# Altium schematic sheet Filter Capacitors - Port A.SchDoc: PORT A Filter Capacitors
size 292 x 193 mm; DocumentNumber: 37; SheetNumber: 25; SheetTotal: 43
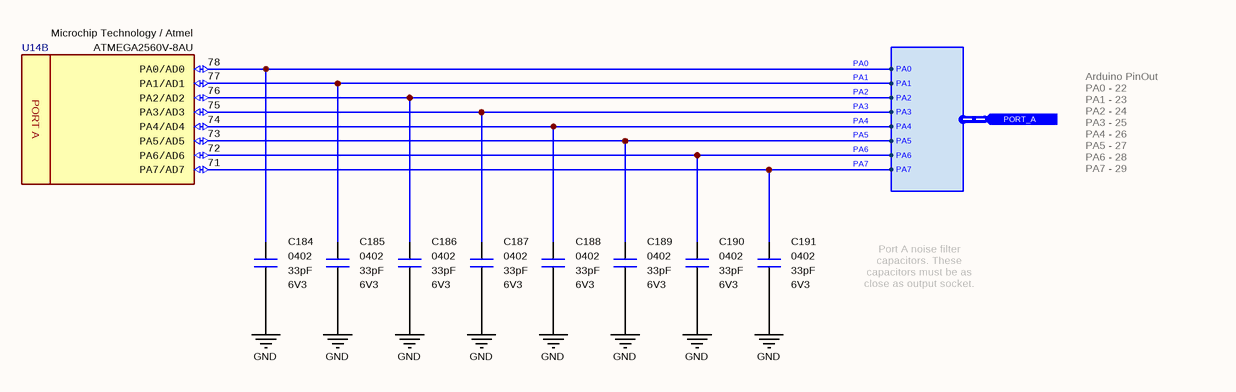
[diagram p0: Filter Capacitors - Port A.SchDoc]

## Parts
C184  value 33pF  Case: 0402  Voltage: 6V3  [CAPACITOR_0402]  (hidden comment: Multilayer Ceramic Capacitor)
C185  value 33pF  Case: 0402  Voltage: 6V3  [CAPACITOR_0402]  (hidden comment: Multilayer Ceramic Capacitor)
C186  value 33pF  Case: 0402  Voltage: 6V3  [CAPACITOR_0402]  (hidden comment: Multilayer Ceramic Capacitor)
C187  value 33pF  Case: 0402  Voltage: 6V3  [CAPACITOR_0402]  (hidden comment: Multilayer Ceramic Capacitor)
C188  value 33pF  Case: 0402  Voltage: 6V3  [CAPACITOR_0402]  (hidden comment: Multilayer Ceramic Capacitor)
C189  value 33pF  Case: 0402  Voltage: 6V3  [CAPACITOR_0402]  (hidden comment: Multilayer Ceramic Capacitor)
C190  value 33pF  Case: 0402  Voltage: 6V3  [CAPACITOR_0402]  (hidden comment: Multilayer Ceramic Capacitor)
C191  value 33pF  Case: 0402  Voltage: 6V3  [CAPACITOR_0402]  (hidden comment: Multilayer Ceramic Capacitor)
U14  Manufacturer Part Number: ATMEGA2560V-8AU  Manufacturer Name: Microchip Technology / Atmel  [TQFP100]  (hidden comment: 8-bit MicroController)  (part B of 15)

## Ports
PORT_A (in, harness PORT_A)

## Harnesses
PORT_A: PA0, PA1, PA2, PA3, PA4, PA5, PA7, PA6

## Nets
GND: C184.1 C185.1 C186.1 C187.1 C188.1 C189.1 C190.1 C191.1
PA0: C184.2 U14.78(PA0/AD0) ; port PORT_A.PA0
PA1: C185.2 U14.77(PA1/AD1) ; port PORT_A.PA1
PA2: C186.2 U14.76(PA2/AD2) ; port PORT_A.PA2
PA3: C187.2 U14.75(PA3/AD3) ; port PORT_A.PA3
PA4: C188.2 U14.74(PA4/AD4) ; port PORT_A.PA4
PA5: C189.2 U14.73(PA5/AD5) ; port PORT_A.PA5
PA6: C190.2 U14.72(PA6/AD6) ; port PORT_A.PA6
PA7: C191.2 U14.71(PA7/AD7) ; port PORT_A.PA7

## Notes on the sheet
- Arduino PinOut
  PA0 - 22
  PA1 - 23
  PA2 - 24
  PA3 - 25
  PA4 - 26
  PA5 - 27
  PA6 - 28
  PA7 - 29
- Port A noise filter capacitors. These capacitors must be as close as output socket.
- © 2021 All rights reserved.
  This document may not, in whole or in part, be copied, photocopied, reproduced, translated or converted to any electronic or machine readable from without prior written permission of Mehmet Günce Akkoyun.
  Engineer contact : akkoyun@me.com
- Property of
- Engineer :
- Date :
- Size :
- A4
- Time :
- Project :
- Page :
- /
- Customer :
- Product ID :
- Module ID :
- Version :
- File :
- Revision :
- (in symbol IC - ATMEGA2560V-8AU, part B) PORT A

## Library data of the parts
C184-C191 = Capacitor - 33pF [0402-6V3]: Capacitor - 33pF [0402] (Ceramic); Manufacturer Name: Kemet; Manufacturer Part Number: C0402C330J9RACAUTO; Dielectric: X7R; Tolerance: 10%; Height: 0.5mm; Maximum Operating Temperature: +125; Minimum Operating Temperature: -55; ROHS: Yes; ComponentLink1Description: DataSheet; ComponentLink1URL: https://api.kemet.com/component-edge/download/datasheet/C0402C330J9RACAUTO.pdf; ComponentLink2Description: Mouser; ComponentLink2URL: https://www.mouser.com/Search/Refine.aspx?Keyword=80-C0402C330J9RAUTO; Supplier 1: Mouser; Supplier Part Number 1: 80-C0402C330J9RAUTO; Mouser Part Number: 80-C0402C330J9RAUTO
U14 = IC - ATMEGA2560V-8AU: 8-bit Microcontrollers - MCU 256kB Flash 4kB EEPROM 86 I/O Pins; Supply Voltage - Min: 2V7; Supply Voltage - Max: 5.5V; Height: 1mm; ComponentLink1Description: DataSheet; ComponentLink1URL: https://eu.mouser.com/datasheet/2/268/Atmel-2549-8-bit-AVR-Microcontroller-ATmega640-128-1315286.pdf; ROHS: Yes; Minimum Operating Temperature: -40; Maximum Operating Temperature: +85; ComponentLink2Description: Mouser; ComponentLink2URL: https://eu.mouser.com/ProductDetail/Microchip-Technology-Atmel/ATMEGA2560V-8AU?qs=sGAEpiMZZMutXGli8Ay4kKlCYcvZUWqJYdtgGFyqFT8%3D; Supplier 1: Digi-Key; Supplier 2: Newark; Supplier 3: Avnet; Supplier 4: RSComponents; Supplier 5: RSComponents; Supplier Part Number 1: ATMEGA2560V-8AU-ND; Supplier Part Number 2: 68T2784; Supplier Part Number 3: 68T2784; Supplier Part Number 4: 1278284P; Supplier Part Number 5: 1278284; Case: TQFP-100; Supplier 6: Mouser; Supplier 7: Future Electronics; Supplier 8: Avnet; Supplier 9: Arrow Electronics; Supplier 10: Farnell; Supplier 11: Allied Electronics; Supplier 12: Future Electronics; Supplier 13: RSComponents; Supplier 14: RSComponents; Supplier 15: RSComponents; Supplier Part Number 6: 556-ATMEGA2560V8AU; Supplier Part Number 7: 4038198; Supplier Part Number 8: ATMEGA2560V-8AU; Supplier Part Number 9: ATMEGA2560V-8AU; Supplier Part Number 10: 1288331; Supplier Part Number 11: 70124009; Supplier Part Number 12: ATMEGA2560V-8AU-TRAY; Supplier Part Number 13: 6963424; Supplier Part Number 14: 6963424P; Supplier Part Number 15: 9220809